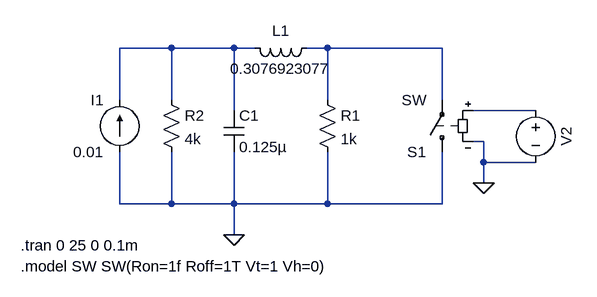
[diagram p0: schematic LTSpice PR 12.asc]
LTSpice PR 12.asc, the LTspice schematic file:
Version 4
SHEET 1 916 680
WIRE 256 96 176 96
WIRE 352 96 256 96
WIRE 384 96 352 96
WIRE 496 96 464 96
WIRE 672 96 496 96
WIRE 176 176 176 96
WIRE 256 176 256 96
WIRE 496 176 496 96
WIRE 672 176 672 96
WIRE 352 192 352 96
WIRE 816 192 720 192
WIRE 736 240 720 240
WIRE 736 272 736 240
WIRE 816 272 736 272
WIRE 736 304 736 272
WIRE 176 336 176 256
WIRE 256 336 256 256
WIRE 256 336 176 336
WIRE 352 336 352 256
WIRE 352 336 256 336
WIRE 496 336 496 256
WIRE 496 336 352 336
WIRE 672 336 672 256
WIRE 672 336 496 336
WIRE 352 384 352 336
FLAG 352 384 0
FLAG 736 304 0
SYMBOL ind 480 80 R90
WINDOW 0 5 56 VBottom 2
WINDOW 3 32 56 VTop 2
SYMATTR InstName L1
SYMATTR Value 0.3076923077
SYMATTR SpiceLine Rser=0.01f
SYMBOL cap 336 192 R0
SYMATTR InstName C1
SYMATTR Value 0.125µ
SYMBOL res 480 160 R0
SYMATTR InstName R1
SYMATTR Value 1k
SYMBOL res 240 160 R0
SYMATTR InstName R2
SYMATTR Value 4k
SYMBOL sw 672 272 R180
SYMATTR InstName S1
SYMBOL voltage 816 176 R0
WINDOW 0 32 56 VTop 2
WINDOW 3 -32 56 Invisible 2
WINDOW 123 0 0 Left 0
WINDOW 39 0 0 Left 0
SYMATTR InstName V2
SYMATTR Value PULSE(0 2 10 1f 1f 200)
SYMBOL current 176 256 R180
WINDOW 0 24 80 Left 2
WINDOW 3 24 0 Left 2
WINDOW 123 0 0 Left 0
WINDOW 39 0 0 Left 0
SYMATTR InstName I1
SYMATTR Value 0.01
TEXT 24 400 Left 2 !.tran 0 25 0 0.1m
TEXT 24 432 Left 2 !.model SW SW(Ron=1f Roff=1T Vt=1 Vh=0)

The netlist it stands for:
* LTSpice PR 12.asc
L1 N002 N001 0.3076923077 Rser=0.01f
C1 N001 0 0.125µ
R1 N002 0 1k
R2 N001 0 4k
S1 0 N002 N003 0 SW
V2 N003 0 PULSE(0 2 10 1f 1f 200)
I1 0 N001 0.01
.tran 0 25 0 0.1m
.model SW SW(Ron=1f Roff=1T Vt=1 Vh=0)
.backanno
.end